# Altium schematic sheet Button.SchDoc
size A; SheetNumber: 2; SheetTotal: 3
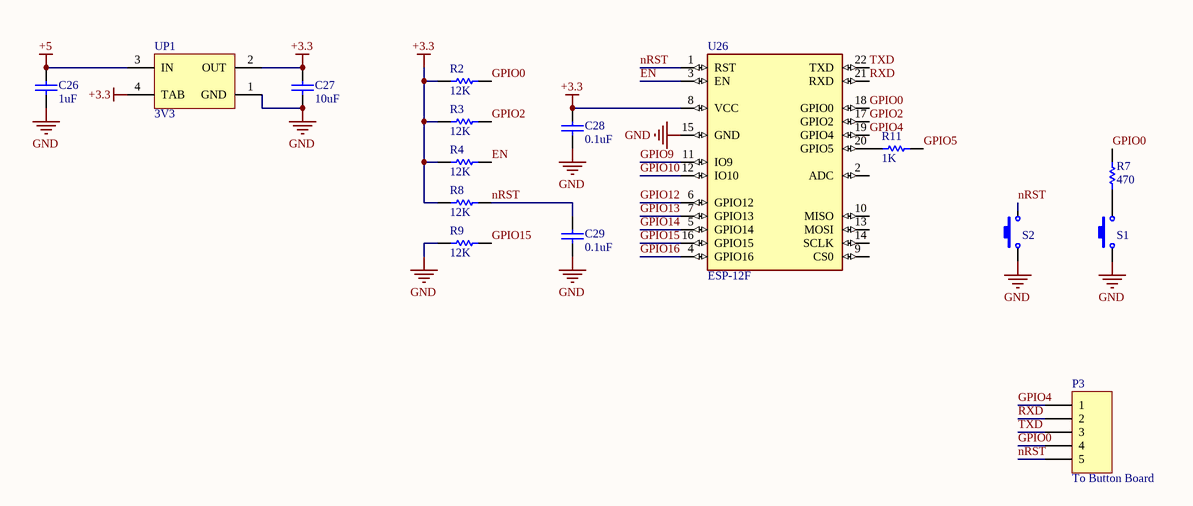
[diagram p0: Button.SchDoc]

## Parts
C26  1uF  [CAPC3413X12N]
C27  10uF  [CAPC3413X12N]
C28  0.1uF  [CAPC3413X12N]
C29  0.1uF  [CAPC3413X12N]
P3  To Button Board  [HDR1X5]
R2  12K  [RES0805]
R3  12K  [RES0805]
R4  12K  [RES0805]
R7  470  [RES0805]
R8  12K  [RES0805]
R9  12K  [RES0805]
R11  1K  [RES0805]
S1  Switch PB  [SW-PB]  (value not drawn)
S2  Switch PB  [SW-PB]  (value not drawn)
U26  ESP-12F  [ESP-12F]
UP1  3V3  [SOT223]

## Nets
+3.3: C27.1 C28.1 R2.1 R3.1 R4.1 R8.1 U26.8(VCC) UP1.2(OUT) UP1.4(TAB)
+5: C26.1 UP1.3(IN)
GND: C26.2 C27.2 C28.2 C29.1 R9.1 S1.1 S2.1 U26.15(GND) UP1.1(GND)
EN: R4.2 U26.3(EN)
GPIO0: P3.4 R2.2 R7.1 U26.18(GPIO0)
GPIO2: R3.2 U26.17(GPIO2)
GPIO4: P3.1 U26.19(GPIO4)
GPIO5: R11.2
GPIO9: U26.11(IO9)
GPIO10: U26.12(IO10)
GPIO12: U26.6(GPIO12)
GPIO13: U26.7(GPIO13)
GPIO14: U26.5(GPIO14)
GPIO15: R9.2 U26.16(GPIO15)
GPIO16: U26.4(GPIO16)
nRST: C29.2 P3.5 R8.2 S2.2 U26.1(RST)
RXD: P3.2 U26.21(RXD)
TXD: P3.3 U26.22(TXD)
NetR7_2: R7.2 S1.2
NetR11_1: R11.1 U26.20(GPIO5)

Not connected (* = marked no-connect by the designer): U26 2(ADC) 9(CS0) 10(MISO) 13(MOSI) 14(SCLK)

## Library data of the parts
C26-C29 = CAP SMD 0805: CAP 0805; Designer: Abbas Basereh; Desc.: CAP SMD 0805; Data: 16-12-2016
P3 = Header 5: Header, 5-Pin; LatestRevisionDate: 17-Jul-2002; LatestRevisionNote: Re-released for DXP Platform.; Publisher: Altium Limited
R2-R4 R7-R9 R11 = RES SMD PACKAGE: TOTAL SMD RESISTOR PACK; Designer: Abbas Basereh; Desc.: RES SMD PAKAGES; Data: 2017-3-10
S1 S2 = Switch PB: Push Button Switch
U26 = ESP-12F: WiFi Module; MF: AI-Thinker; Price: None; SnapEDA_Link: https://www.snapeda.com/parts/ESP-12F/AI-Thinker/view-part/6648243/?ref=snap; Check_prices: https://www.snapeda.com/parts/ESP-12F/AI-Thinker/view-part/6648243/?ref=eda; Availability: No availability data; Value: *; MP: ESP-12F; Package: Package
UP1 = AMS1117-x.x: x.x Volt, 800mA Low-Dropout Linear Regulator, 4-pin SOT-223; Designer: Ali Hafizi; Data: 16-12-2016